# Altium schematic sheet PSInputFiltering.SchDoc
size A; SheetNumber: 10; SheetTotal: 10
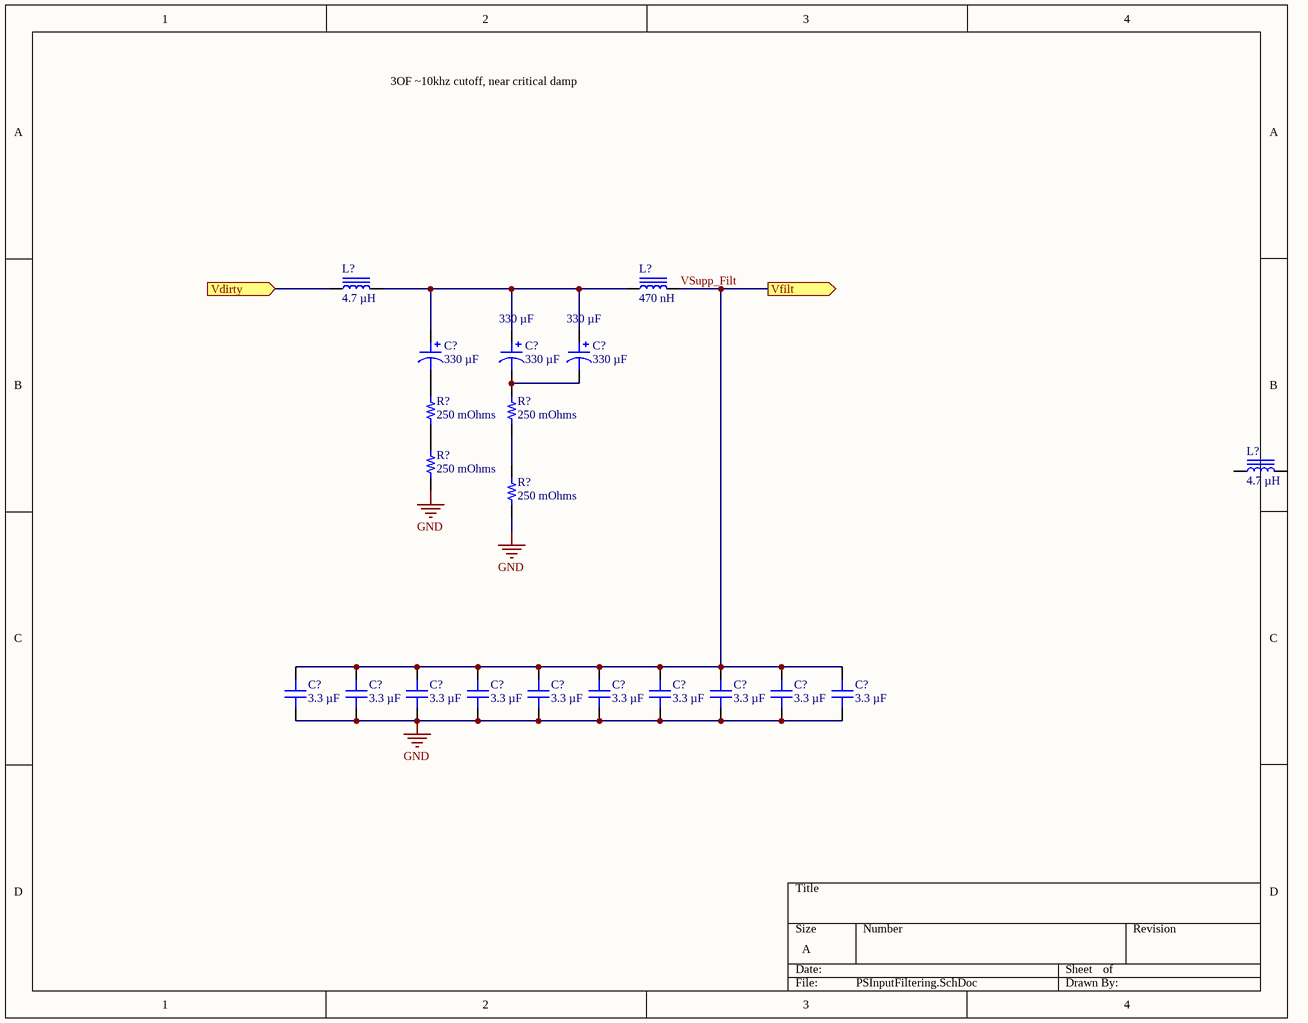
[diagram p0: PSInputFiltering.SchDoc]

## Parts
(Parts that share a designator on the sheet are numbered #1, #2 ... from top to bottom, then left to right.)
C?#1  330 µF  [CAP ALSMD 8.3MM H10.5MM]
C?#2  330 µF  [CAP ALSMD 8.3MM H10.5MM]
C?#3  330 µF  [CAP ALSMD 8.3MM H10.5MM]
C?#4  3.3 µF  [CAP 0805_2012]
C?#5  3.3 µF  [CAP 0805_2012]
C?#6  3.3 µF  [CAP 0805_2012]
C?#7  3.3 µF  [CAP 0805_2012]
C?#8  3.3 µF  [CAP 0805_2012]
C?#9  3.3 µF  [CAP 0805_2012]
C?#10  3.3 µF  [CAP 0805_2012]
C?#11  3.3 µF  [CAP 0805_2012]
C?#12  3.3 µF  [CAP 0805_2012]
C?#13  3.3 µF  [CAP 0805_2012]
L?#1  4.7 µH  [WURTH WE-HCI 7040]
L?#2  470 nH  [WURTH 5040]
L?#3  4.7 µH  [WURTH WE-HCI 7040]
R?#1  250 mOhms  [RES 1210_3225]
R?#2  250 mOhms  [RES 1210_3225]
R?#3  250 mOhms  [RES 1210_3225]
R?#4  250 mOhms  [RES 1210_3225]

## Ports
Vdirty (in), Vfilt (out)

## Nets
GND: C?#4.1 C?#5.1 C?#6.1 C?#7.1 C?#8.1 C?#9.1 C?#10.1 C?#11.1 C?#12.1 C?#13.1 R?#3.1 R?#4.1
Vdirty: L?#1.1 ; port Vdirty
VSupp_Filt: C?#4.2 C?#5.2 C?#6.2 C?#7.2 C?#8.2 C?#9.2 C?#10.2 C?#11.2 C?#12.2 C?#13.2 L?#2.2 ; port Vfilt
NetC?#1_1: C?#1.1 C?#2.1 C?#3.1 L?#1.2 L?#2.1
NetC?#1_2: C?#1.2 R?#1.2
NetC?#2_2: C?#2.2 C?#3.2 R?#2.2
NetR?#1_1: R?#1.1 R?#3.2
NetR?#2_1: R?#2.1 R?#4.2

Not connected (* = marked no-connect by the designer): L?#3 1 2

## Notes on the sheet
- 3OF ~10khz cutoff, near critical damp

## Library data of the parts
C?#1-C?#3 = UCM1V331MNL1GS: CAP ALUM 330UF 20% 35V SMD; manufacturer: Nichicon; Impedance: 80 mOhms; Lifetime @ Temp.: 2000 Hrs @ 105°C; Polarization: Polar; Ripple Current @ High Frequency: 850 mA @ 100 kHz; Ripple Current @ Low Frequency: 425 mA @ 120 Hz; Surface Mount Land Size: 0.327" L x 0.327" W (8.30mm x 8.30mm); Part Number: UCM1V331MNL1GS; Applications: Automotive; Capacitance: 330 µF; componentlink1description: Datasheet; componentlink1url: http://nichicon-us.com/english/products/pdfs/e-ucm.pdf; componentlink2description: DigiKey Link; componentlink2url: https://www.digikey.com/en/products/detail/nichicon/UCM1V331MNL1GS/4991864; Device Package: Radial, Can - SMD; Height - Seated (Max): 0.413" (10.50mm); lastupdated: 6/2/2023 8:33:36 PM; Lifecycle Status: Active; Minimum Order: 1; Mounting Type: Surface Mount; Operating Temperature: -55°C ~ 105°C; Package / Case: Radial, Can - SMD; packaging: TapeAndReel; partid: 7822; Part Status: Active; price: 0.20; Ratings: AEC-Q200; series: UCM; Size / Dimension: 0.315" Dia (8.00mm); Supplier 1: DigiKey; Supplier Part Number 1: 493-14539-1-ND; Tolerance: ±20%; value: 330 µF; Voltage - Rated: 35 V
C?#4-C?#13 = CGA4J3X5R1H335K125AB: CAP CER 3.3UF 50V X5R 0805; manufacturer: TDK Corporation; Tolerance: ±10%; Part Number: CGA4J3X5R1H335K125AB; Value: 3.3 µF; Applications: Automotive; Capacitance: 3.3 µF; componentlink1description: Datasheet; componentlink1url: https://product.tdk.com/info/en/catalog/datasheets/mlcc_automotive_general_en.pdf?ref_disty=digikey; componentlink2description: DigiKey Link; componentlink2url: https://www.digikey.com/en/products/detail/tdk-corporation/CGA4J3X5R1H335K125AB/2781307; Device Package: 0805 (2012 Metric); lastupdated: 6/3/2023 7:16:47 PM; Lifecycle Status: Active; Minimum Order: 1; Mounting Type: Surface Mount, MLCC; Operating Temperature: -55°C ~ 85°C; Package / Case: 0805 (2012 Metric); packaging: TapeAndReel; partid: 17493; Part Status: Active; price: 0.14; Ratings: AEC-Q200; series: CGA; Size / Dimension: 0.079" L x 0.049" W (2.00mm x 1.25mm); Supplier 1: DigiKey; Supplier Part Number 1: 445-7881-1-ND; Temperature Coefficient: X5R; Thickness (Max): 0.057" (1.45mm); Voltage - Rated: 50V
L?#1 L?#3 = 744311470: FIXED IND 4.7UH 6A 19.5 MOHM SMD; Manufacturer: Würth Elektronik; Current - Saturation: 7A; Frequency - Self Resonant: 33MHz; Inductance Frequency - Test: 100 kHz; Material - Core: Nonstandard; Shielding: Shielded; Tolerance: ±20%; Type: Wirewound; Part Number: 744311470; ComponentLink1Description: Datasheet; ComponentLink1URL: https://katalog.we-online.de/pbs/datasheet/744311470.pdf; ComponentLink2Description: DigiKey Link; ComponentLink2URL: https://www.digikey.com/en/products/detail/würth-elektronik/744311470/1638558; Current Rating (Amps): 6 A; DC Resistance (DCR): 19.5mOhm; Device Package: Nonstandard; Height - Seated (Max): 0.157" (4.00mm); Inductance: 4.7 µH; LastUpdated: 6/3/2023 8:33:14 PM; Lifecycle Status: Active; Minimum Order: 1; Mounting Type: Surface Mount; Operating Temperature: -40°C ~ 150°C; Package / Case: Nonstandard; Packaging: TapeAndReel; PartId: 258; Part Status: Active; Price: 2.72; Ratings: AEC-Q200; Series: WE-HCI; Size / Dimension: 0.276" L x 0.272" W (7.00mm x 6.90mm); Supplier 1: DigiKey; Supplier Part Number 1: 732-1153-1-ND; Supplier Device Package: 7040; Value: 4.7 µH
L?#2 = 744316047: FIXED IND 470NH 15A 2.75MOHM SMD; Manufacturer: Würth Elektronik; Current - Saturation: 16A; Frequency - Self Resonant: 280MHz; Inductance Frequency - Test: 100 kHz; Material - Core: 2-SMD; Shielding: Shielded; Tolerance: ±20%; Type: Wirewound; Part Number: 744316047; ComponentLink1Description: Datasheet; ComponentLink1URL: https://katalog.we-online.de/pbs/datasheet/744316047.pdf; ComponentLink2Description: DigiKey Link; ComponentLink2URL: https://www.digikey.com/en/products/detail/würth-elektronik/744316047/5051007; Current Rating (Amps): 15 A; DC Resistance (DCR): 2.75mOhm; Height - Seated (Max): 0.169" (4.30mm); Inductance: 470 nH; LastUpdated: 6/3/2023 8:33:14 PM; Lifecycle Status: Active; Minimum Order: 1; Mounting Type: Surface Mount; Operating Temperature: -40°C ~ 150°C; Package / Case: 2-SMD; Packaging: TapeAndReel; PartId: 255; Part Status: Active; Price: 1.72; Ratings: AEC-Q200; Series: WE-HCI; Size / Dimension: 0.217" L x 0.209" W (5.50mm x 5.30mm); Supplier 1: DigiKey; Supplier Part Number 1: 732-6174-1-ND; Supplier Device Package: 5040; Value: 470 nH
R?#1-R?#4 = RL1210FR-070R25L: RES 0.25 OHM 1% 1/2W 1210; Manufacturer: Yageo; Power (Watts): 0.5W, 1/2W; Temperature Coefficient: ±600ppm/°C; Part Number: RL1210FR-070R25L; ComponentLink1Description: Datasheet; ComponentLink1URL: https://www.yageo.com/upload/media/product/productsearch/datasheet/rchip/PYu-RL_Group_521_RoHS_L_2.pdf; ComponentLink2Description: DigiKey Link; ComponentLink2URL: https://www.digikey.com/en/products/detail/yageo/RL1210FR-070R25L/5925214; Composition: Thick Film; Device Package: 1210 (3225 Metric); Features: Automotive AEC-Q200, Current Sense, Moisture Resistant; Height - Seated (Max): 0.026" (0.65mm); LastUpdated: 6/2/2023 8:36:28 PM; Lifecycle Status: Active; Minimum Order: 1; Number of Terminations: 2; Operating Temperature: -55°C ~ 155°C; Package / Case: 1210 (3225 Metric); Packaging: TapeAndReel; Part Status: Active; Price: 0.07; Ratings: AEC-Q200; Resistance: 250 mOhms; Series: RL; Size / Dimension: 0.122" L x 0.102" W (3.10mm x 2.60mm); Supplier 1: DigiKey; Supplier Part Number 1: 13-RL1210FR-070R25LCT-ND; Supplier Device Package: 1210; Tolerance: ±1%; Value: 250 mOhms